# EAGLE design Pi_Observer_board_schematic (EAGLE 9.4.2)
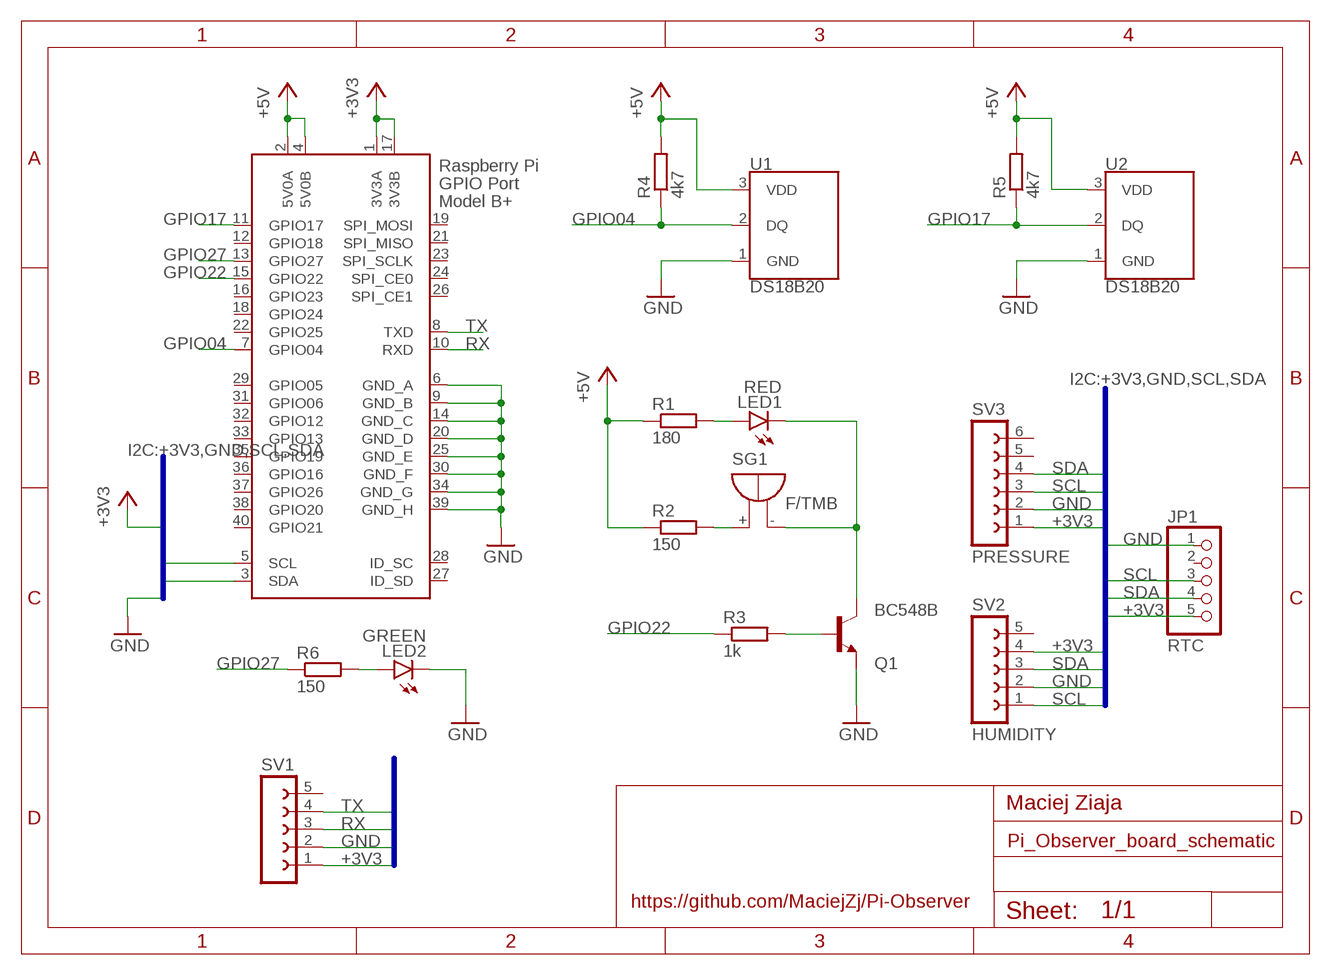
[diagram p0: schematic, sheet 1]

## Parts
JP1  RTC  PINHD-1X5  [1X05]
LED1  RED  LED5MM  [LED5MM]
LED2  GREEN  LED5MM  [LED5MM]
Q1  BC548B  [TO92-EBC]
R1  180  R-EU_M1206  [M1206]
R2  150  R-EU_M1206  [M1206]
R3  1k  R-EU_M1206  [M1206]
R4  4k7  R-EU_M1206  [M1206]
R5  4k7  R-EU_M1206  [M1206]
R6  150  R-EU_M1206  [M1206]
SG1  F/TMB  [F/TMB]
SV1  FE05-1  [FE05-1]
SV2  HUMIDITY  FE05-1  [FE05-1]
SV3  PRESSURE  FE06-1  [FE06]
U1  DS18B20  [TO-92-AMMO]
U2  DS18B20  [TO-92-AMMO]
X1  RASPI_GPIO_B+#_PIN  [RASPI_GPIO_B+_PIN]

## Nets
+3V3: JP1.5 SV1.1 SV2.4 SV3.1 X1.1(3V3A) X1.17(3V3B)
+5V: R1.1 R2.1 R4.2 R5.2 U1.3(VDD) U2.3(VDD) X1.2(5V0A) X1.4(5V0B)
GND: JP1.1 LED2.K(C) Q1.E SV1.2 SV2.2 SV3.2 U1.1(GND) U2.1(GND) X1.6(GND_A) X1.9(GND_B) X1.14(GND_C) X1.20(GND_D) X1.25(GND_E) X1.30(GND_F) X1.34(GND_G) X1.39(GND_H)
GPIO04: R4.1 U1.2(DQ) X1.7(GPIO04)
GPIO17: R5.1 U2.2(DQ) X1.11(GPIO17)
GPIO22: R3.1 X1.15(GPIO22)
GPIO27: R6.1 X1.13(GPIO27)
N$1: LED1.K(C) Q1.C SG1.-
N$2: R2.2 SG1.+
N$3: LED1.A R1.2
N$5: Q1.B R3.2
N$9: LED2.A R6.2
RX: SV1.3 X1.10(RXD)
SCL: JP1.3 SV2.1 SV3.3 X1.5(SCL)
SDA: JP1.4 SV2.3 SV3.4 X1.3(SDA)
TX: SV1.4 X1.8(TXD)
Unconnected: JP1.2 SV1.5 SV2.5 SV3.5 SV3.6 X1.12(GPIO18) X1.16(GPIO23) X1.18(GPIO24) X1.19(SPI_MOSI) X1.21(SPI_MISO) X1.22(GPIO25) X1.23(SPI_SCLK) X1.24(SPI_CE0) X1.26(SPI_CE1) X1.27(ID_SD) X1.28(ID_SC) X1.29(GPIO05) X1.31(GPIO06) X1.32(GPIO12) X1.33(GPIO13) X1.35(GPIO19) X1.36(GPIO16) X1.37(GPIO26) X1.38(GPIO20) X1.40(GPIO21)

## Buses
I2C:+3V3,GND,SCL,SDA
UART:+3V3,GND,RX,TX

## Notes on the sheet
- Maciej Ziaja
- https://github.com/MaciejZj/Pi-Observer

## Library data of the parts
JP1 = pinhead:PINHD-1X5: PIN HEADER
LED1 LED2 = led:LED: LED OSRAM: - CHIPLED LG R971, LG N971, LY N971, LG Q971, LY Q971, LO R971, LY R971 LH N974, LH R974 LS Q976, LO Q976, LY Q976 LO Q996 - Hyper CHIPLED LW Q18S LB Q993, LB Q99A, LB R99A - SideLED LS A670, LO A670, LY A670, LG A670, LP A670 LB A673, LV A673, LT A673, LW A673 LH A674 LY A675 LS A676, LA A676, LO A676, LY A676, LW A676 LS A679, LY A679, LG A679 - Hyper Micro SIDELED® LS Y876, LA Y876, LO Y876, LY Y876 LT Y87S - SmartLED LW L88C, LW L88S LB L89C, LB L89S, LG L890 LS L89K, LO L89K, LY L89K LS L896, LA L896, LO L896, LY L896 - TOPLED LS T670, LO T670, LY T670, LG T670, LP T670 LSG T670, LSP T670, LSY T670, LOP T670, LYG T670 LG T671, LOG T671, LSG T671 LB T673, LV T673, LT T673, LW T673 LH T674 LS T676, LA T676, LO T676, LY T676, LB T676, LH T676, LSB T676, LW T676 LB T67C, LV T67C, LT T67C, LS T67K, LO T67K, LY T67K, LW E67C LS E67B, LA E67B, LO E67B, LY E67B, LB E67C, LV E67C, LT E67C LW T67C LS T679, LY T679, LG T679 LS T770, LO T770, LY T770, LG T770, LP T770 LB T773, LV T773, LT T773, LW T773 LH T774 LS E675, LA E675, LY E675, LS T675 LS T776, LA T776, LO T776, LY T776, LB T776 LHGB T686 LT T68C, LB T68C - Hyper Mini TOPLED® LB M676 - Mini TOPLED Santana® LG M470 LS M47K, LO M47K, LY M47K Source: http://www.osram.convergy.de LUXEON: - LUMILED® LXK2-PW12-R00, LXK2-PW12-S00, LXK2-PW14-U00, LXK2-PW14-V00 LXK2-PM12-R00, LXK2-PM12-S00, LXK2-PM14-U00 LXK2-PE12-Q00, LXK2-PE12-R00, LXK2-PE12-S00, LXK2-PE14-T00, LXK2-PE14-U00 LXK2-PB12-K00, LXK2-PB12-L00, LXK2-PB12-M00, LXK2-PB14-N00, LXK2-PB14-P00, LXK2-PB14-Q00 LXK2-PR12-L00, LXK2-PR12-M00, LXK2-PR14-Q00, LXK2-PR14-R00 LXK2-PD12-Q00, LXK2-PD12-R00, LXK2-PD12-S00 LXK2-PH12-R00, LXK2-PH12-S00 LXK2-PL12-P00, LXK2-PL12-Q00, LXK2-PL12-R00 Source: www.luxeon.com KINGBRIGHT: KA-3528ASYC Source: www.kingbright.com
Q1 = transistor-npn:BC548*: NPN Transistor
R1-R6 = rcl:R-EU_: RESISTOR, European symbol; SPICEPREFIX: R
SG1 = buzzer:F/TMB: BUZZER Source: Buerklin; OC_FARNELL: unknown; OC_NEWARK: unknown
SV1 SV2 = con-lsta:FE05-1: FEMALE HEADER; OC_FARNELL: unknown; OC_NEWARK: unknown
SV3 = con-lsta:FE06-1: FEMALE HEADER; OC_FARNELL: unknown; OC_NEWARK: unknown
U1 U2 = SparkFun-Sensors:DS18B20: Dallas/Maxim DS18B20 1-Wire Temperature Sensor The DS18B20 reports degrees C with 9 to 12-bit precision, -55C to 125C (+/-0.5C). Each sensor has a unique 64-Bit Serial number etched into it - allows for a huge number of sensors to be used on one data bus. Datasheet <http://datasheets.maximintegrated.com/en/ds/DS18B20.pdf> SparkFun Products One Wire Digital Temperature Sensor - DS18B20 <https://www.sparkfun.com/products/245> (SEN-00245); STORE_ID: SEN-00245
X1 = raspberrypi_bastelstube_v13:RASPI_GPIO_B+#: 2x20 header connector, all pins connected

## Board
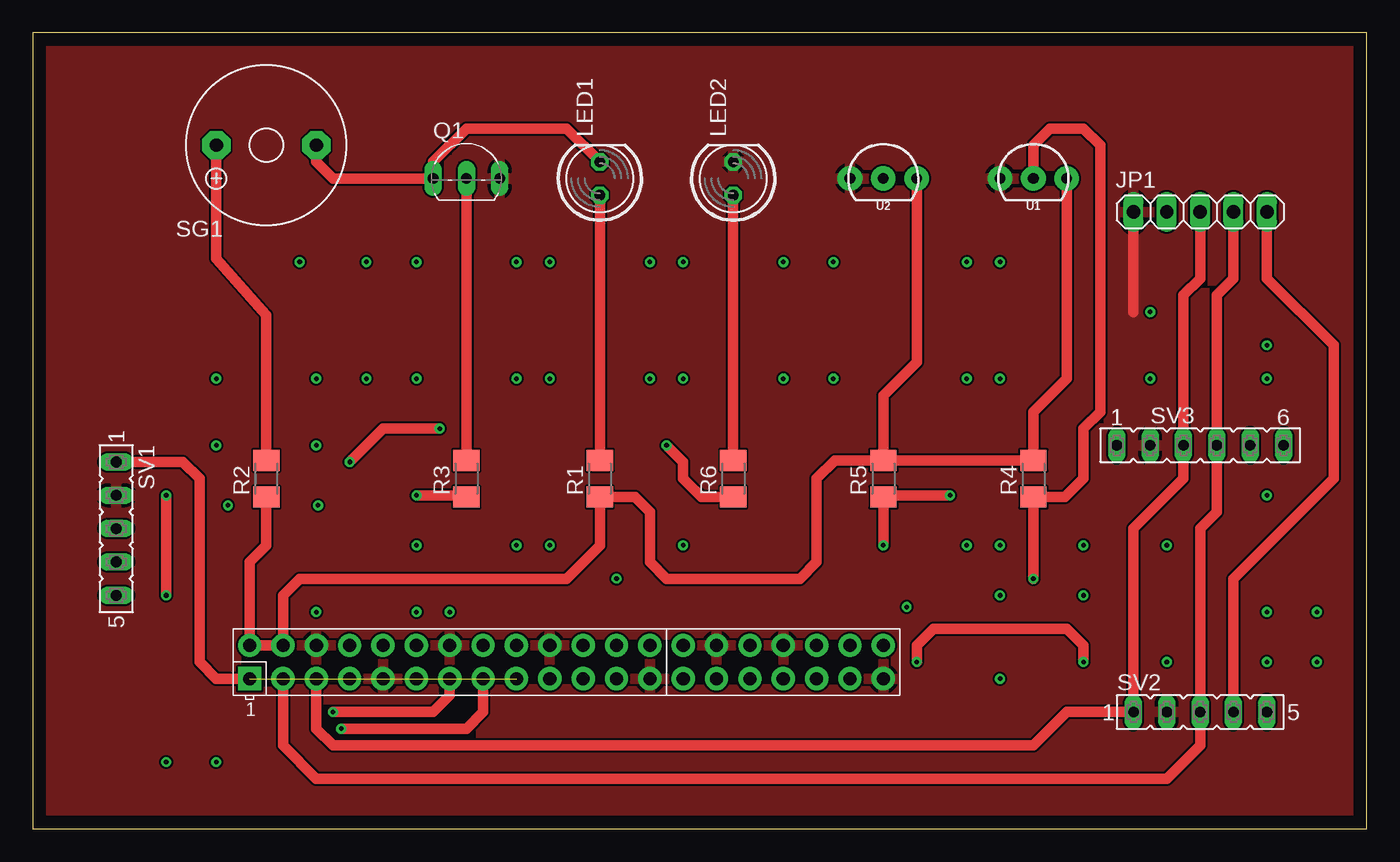
[diagram p1: board, top side]
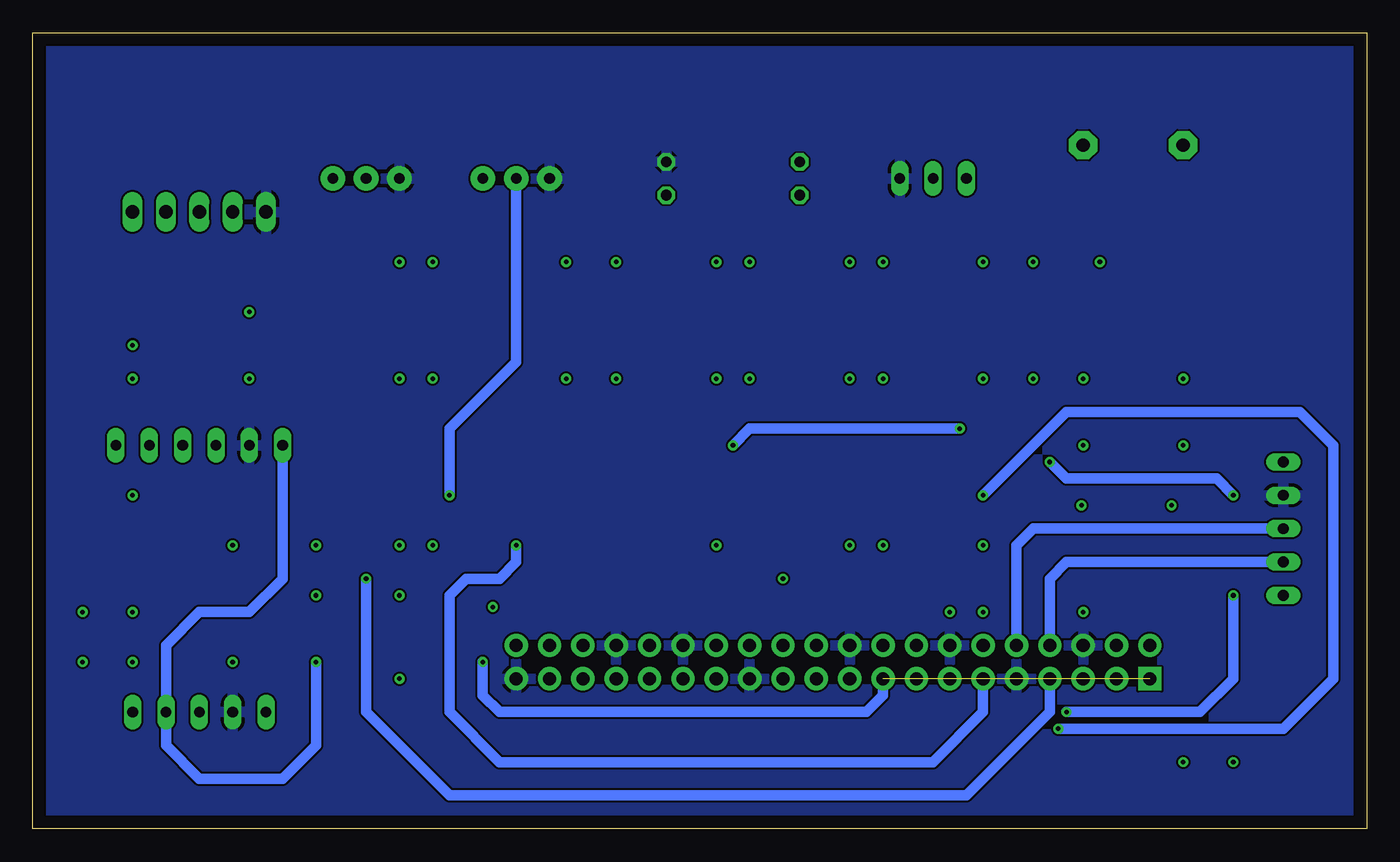
[diagram p2: board, bottom side, seen from below]

Size 101.58 x 60.63 mm. Coordinates in mm from the lower left corner, seen from the top.
Outline: 0,0 101.58,0 101.58,60.63 0,60.63 0,0
Copper layers (1*16): Top 0.035mm / dielectric 1.5mm / Bottom 0.035mm
Design rules "default": minimum track width 6mil, minimum drill 0.35mm, track to track 6mil, track to pad 6mil, pad to pad 6mil, via to via 6mil, smd to smd 6mil, copper to edge 40mil, drill to drill 6mil, minimum pad ring 10mil, minimum via ring 8mil, stop-mask expansion 4mil, vias tented up to drill 0mil, thermal gap 10mil

### Footprints (pad centres in the part's own frame; a part is rotated, then mirrored left to right if it is on the bottom)
1X05 = drill 1.016 long: 1 -5.08,0; 2 -2.54,0; 3 0,0; 4 2.54,0; 5 5.08,0
LED5MM = drill 0.813 octagon: A -1.27,0; K 1.27,0
TO92-EBC = drill 0.813 long: B 0,-1.27; C -2.54,-1.27; E 2.54,-1.27
M1206 = smd 1.6 x 2: 1 -1.4,0; 2 1.4,0
F/TMB = drill 1.016 pad 2.159 octagon: + 3.81,0; - -3.81,0
FE05-1 = drill 0.813 long: 1 -5.08,0; 2 -2.54,0; 3 0,0; 4 2.54,0; 5 5.08,0
FE06 = drill 0.813 long: 1 -6.35,0; 2 -3.81,0; 3 -1.27,0; 4 1.27,0; 5 3.81,0; 6 6.35,0
TO-92-AMMO = drill 0.813 pad 1.88: 1 -2.54,0; 2 0,0; 3 2.54,0
RASPI_GPIO_B+_PIN = drill 1 pad 1.778 square: 1 -24.13,-1.27 | drill 1 pad 1.778: 2 -24.13,1.27; 3 -21.59,-1.27; 4 -21.59,1.27; 5 -19.05,-1.27; 6 -19.05,1.27; 7 -16.51,-1.27; 8 -16.51,1.27; 9 -13.97,-1.27; 10 -13.97,1.27; 11 -11.43,-1.27; 12 -11.43,1.27; 13 -8.89,-1.27; 14 -8.89,1.27; 15 -6.35,-1.27; 16 -6.35,1.27; 17 -3.81,-1.27; 18 -3.81,1.27; 19 -1.27,-1.27; 20 -1.27,1.27; 21 1.27,-1.27; 22 1.27,1.27; 23 3.81,-1.27; 24 3.81,1.27; 25 6.35,-1.27; 26 6.35,1.27; 27 8.89,-1.27; 28 8.89,1.27; 29 11.43,-1.27; 30 11.43,1.27; 31 13.97,-1.27; 32 13.97,1.27; 33 16.51,-1.27; 34 16.51,1.27; 35 19.05,-1.27; 36 19.05,1.27; 37 21.59,-1.27; 38 21.59,1.27; 39 24.13,-1.27; 40 24.13,1.27

### Placement (x,y rotation side)
JP1  88.9,46.99 0 top
LED1  43.18,49.53 90 top
LED2  53.34,49.53 90 top
Q1  33.02,50.8 0 top
R1  43.18,26.67 90 top
R2  17.78,26.67 90 top
R3  33.02,26.67 90 top
R4  76.2,26.67 90 top
R5  64.77,26.67 90 top
R6  53.34,26.67 90 top
SG1  17.78,52.07 180 top
SV1  6.35,22.86 270 top
SV2  88.9,8.89 0 top
SV3  88.9,29.21 0 top
U1  76.2,49.53 0 top
U2  64.77,49.53 0 top
X1  40.64,12.7 0 top

### Tracks (layer width: path | path; a pad name or v marks a point on that pad's centre or on a via)
+3V3  (via drill 0.35)  (1 unrouted)
  Top 0.813: SV2.4 91.44,19.05 99.06,26.67 99.06,36.83 93.98,41.91 JP1.5 | X1.1 13.97,11.43 12.7,12.7 12.7,26.67 11.43,27.94 SV1.1 | v67.31,12.7 67.31,13.97 68.58,15.24 78.74,15.24 80.01,13.97 v80.01,12.7
  Bottom 0.813: SV3.1 82.55,19.05 85.09,16.51 88.9,16.51 91.44,13.97 SV2.4 91.44,6.35 88.9,3.81 82.55,3.81 80.01,6.35 v80.01,12.7 | X1.17 36.83,10.16 38.1,8.89 66.04,8.89 67.31,10.16 v67.31,12.7
+5V
  Top 0.813: R2.1 17.78,21.59 16.51,20.32 X1.2 X1.4 19.05,17.78 20.32,19.05 40.64,19.05 43.18,21.59 R1.1 | R5.2 64.77,33.02 67.31,35.56 U2.3 | U1.3 78.74,34.29 76.2,31.75 R4.2 R5.2 | R1.1 43.31,25.4 | R5.2 61.09,28.07 59.69,26.67 59.69,20.32 58.42,19.05 48.26,19.05 46.99,20.32 46.99,24.13 45.85,25.27 R1.1
GND
  Top 0.813: 83.82,39.37 JP1.1
  pour Top: -5.08,66.04 -5.08,-6.35 111.76,-6.35 111.76,66.04
  pour Bottom: -5.08,66.04 -5.08,-6.35 111.76,-6.35 111.76,66.04
GPIO04  (via drill 0.35)
  Top 0.813: v76.2,19.05 R4.1 78.61,25.27 80.01,26.67 80.01,30.48 81.28,31.75 81.28,52.07 80.01,53.34 77.47,53.34 76.2,52.07 U1.2
  Bottom 0.813: X1.7 24.13,8.89 30.48,2.54 69.85,2.54 76.2,8.89 v76.2,19.05
GPIO17  (via drill 0.35)
  Top 0.813: v64.77,21.59 R5.1 64.9,25.4 v69.85,25.4
  Bottom 0.813: X1.11 29.21,8.89 33.02,5.08 66.04,5.08 69.85,8.89 69.85,17.78 68.58,19.05 66.04,19.05 64.77,20.32 v64.77,21.59 | v69.85,25.4 69.85,30.48 64.77,35.56 U2.2
GPIO22  (via drill 0.35)
  Top 0.813: X1.15 34.29,8.89 33.02,7.62 v23.5,7.62 | v29.21,25.4 32.89,25.4 R3.1
  Bottom 0.813: v29.21,25.4 22.86,31.75 5.08,31.75 2.54,29.21 2.54,11.43 6.35,7.62 v23.5,7.62
GPIO27  (via drill 0.35)
  Top 0.813: X1.13 31.75,10.16 30.48,8.89 v22.86,8.89 | v48.26,29.21 49.53,27.94 49.53,26.67 50.93,25.27 R6.1 | v10.16,17.78 v10.16,25.4 | v24.13,27.94 26.67,30.48 v30.99,30.48
  Bottom 0.813: v30.99,30.48 46.99,30.48 v48.26,29.21 | v22.86,8.89 12.7,8.89 10.16,11.43 v10.16,17.78 | v10.16,25.4 11.43,26.67 22.86,26.67 v24.13,27.94
N$1
  Top 0.813: LED1.K 40.64,53.34 33.02,53.34 30.48,50.8 Q1.C 22.86,49.53 21.59,50.8 SG1.-
N$2
  Top 0.813: SG1.+ 13.98,43.42 17.78,39.14 R2.2
N$3
  Top 0.813: R1.2 LED1.A
N$4  (via drill 0.35)
  other vias: 21.59,34.29
N$5
  Top 0.813: Q1.B R3.2
N$6  (via drill 0.35)
  other vias: 25.4,34.29
N$7  (via drill 0.35)
  other vias: 29.21,34.29
N$8  (via drill 0.35)
  other vias: 36.83,34.29
N$9
  Top 0.813: R6.2 LED2.A
N$10  (via drill 0.35)
  other vias: 39.37,34.29
N$11  (via drill 0.35)
  other vias: 46.99,34.29
N$12  (via drill 0.35)
  other vias: 49.53,34.29
N$13  (via drill 0.35)
  other vias: 57.15,34.29
N$14  (via drill 0.35)
  other vias: 60.96,34.29
N$15  (via drill 0.35)
  other vias: 13.97,34.29
N$16  (via drill 0.35)
  other vias: 39.37,43.18
N$17  (via drill 0.35)
  other vias: 36.83,43.18
N$18  (via drill 0.35)
  other vias: 29.21,21.59
N$19  (via drill 0.35)
  other vias: 29.21,16.51
N$20  (via drill 0.35)
  other vias: 31.75,16.51
N$21  (via drill 0.35)
  other vias: 21.59,16.51
N$22  (via drill 0.35)
  other vias: 13.97,29.21
N$23  (via drill 0.35)
  other vias: 29.21,43.18
N$24  (via drill 0.35)
  other vias: 25.4,43.18
N$25  (via drill 0.35)
  other vias: 20.32,43.18
N$26  (via drill 0.35)
  other vias: 46.99,43.18
N$27  (via drill 0.35)
  other vias: 71.12,34.29
N$28  (via drill 0.35)
  other vias: 73.66,34.29
N$29  (via drill 0.35)
  other vias: 73.66,21.59
N$30  (via drill 0.35)
  other vias: 71.12,21.59
N$31  (via drill 0.35)
  other vias: 86.36,21.59
N$32  (via drill 0.35)
  other vias: 80.01,21.59
N$33  (via drill 0.35)
  other vias: 80.01,17.78
N$34  (via drill 0.35)
  other vias: 73.66,17.78
N$35  (via drill 0.35)
  other vias: 85.09,34.29
N$36  (via drill 0.35)
  other vias: 85.09,39.37
N$37  (via drill 0.35)
  other vias: 86.36,12.7
N$38  (via drill 0.35)
  other vias: 93.98,34.29
N$39  (via drill 0.35)
  other vias: 93.98,25.4
N$40  (via drill 0.35)
  other vias: 93.98,16.51
N$41  (via drill 0.35)
  other vias: 93.98,12.7
N$42  (via drill 0.35)
  other vias: 97.79,16.51
N$43  (via drill 0.35)
  other vias: 97.79,12.7
N$47  (via drill 0.35)
  other vias: 36.83,21.59
N$48  (via drill 0.35)
  other vias: 39.37,21.59
N$49  (via drill 0.35)
  other vias: 44.45,19.05
N$50  (via drill 0.35)
  other vias: 49.53,21.59
N$51  (via drill 0.35)
  other vias: 66.55,16.89
N$52  (via drill 0.35)
  other vias: 73.66,11.43
N$53  (via drill 0.35)
  other vias: 93.98,36.83
N$54  (via drill 0.35)
  other vias: 49.53,43.18
N$55  (via drill 0.35)
  other vias: 13.97,5.08
N$56  (via drill 0.35)
  other vias: 10.16,5.08
N$58  (via drill 0.35)
  other vias: 57.15,43.18
N$59  (via drill 0.35)
  other vias: 60.96,43.18
N$60  (via drill 0.35)
  other vias: 71.12,43.18
N$61  (via drill 0.35)
  other vias: 73.66,43.18
N$63  (via drill 0.35)
  other vias: 21.59,29.21
N$64  (via drill 0.35)
  other vias: 14.86,24.64
N$65  (via drill 0.35)
  other vias: 21.72,24.64
RX
  Bottom 0.813: X1.10 26.67,21.59 25.4,22.86 SV1.3
SCL
  Top 0.813: JP1.3 88.9,41.91 87.63,40.64 SV3.3 87.63,26.67 83.82,22.86 SV2.1 78.74,8.89 76.2,6.35 22.86,6.35 21.59,7.62 X1.5
SDA
  Top 0.813: JP1.4 91.44,41.91 90.17,40.64 SV3.4 90.17,24.13 88.9,22.86 SV2.3 88.9,6.35 86.36,3.81 21.59,3.81 19.05,6.35 X1.3
TX
  Bottom 0.813: SV1.4 22.86,20.32 24.13,19.05 X1.8